# Altium schematic sheet UART.SchDoc
size A; SheetNumber: 12; SheetTotal: 12
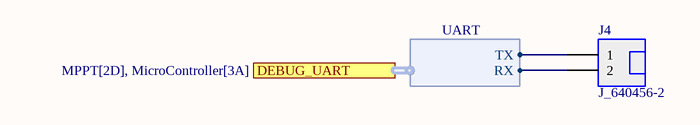
[diagram p0: UART.SchDoc]

## Parts
J4  J_640456-2  [J_640456-2]

## Ports
DEBUG_UART (harness UART, see MPPT[2D], MicroController[3A])

## Harnesses
UART: TX, RX

## Nets
NetJ4_1: J4.1 ; port DEBUG_UART.TX
NetJ4_2: J4.2 ; port DEBUG_UART.RX

## Library data of the parts
J4 = CMP-002-00087-1: Connector Header Through Hole 2 position 0.100" (2.54mm); Manufacturer: TE Connectivity; Voltage Rating: 250V; Contact Resistance: 6mR; Current Rating: 5A; Manufacturer Part Number: 640456-2; Design Item ID: J_640456-2; Source: connector.SchLib; Max Operating Temperature: 221°C; Min Operating Temperature: -67°C